# EasyEDA Pro project TF_MUX_v0.8.0-rc.epro, board PCB5_3
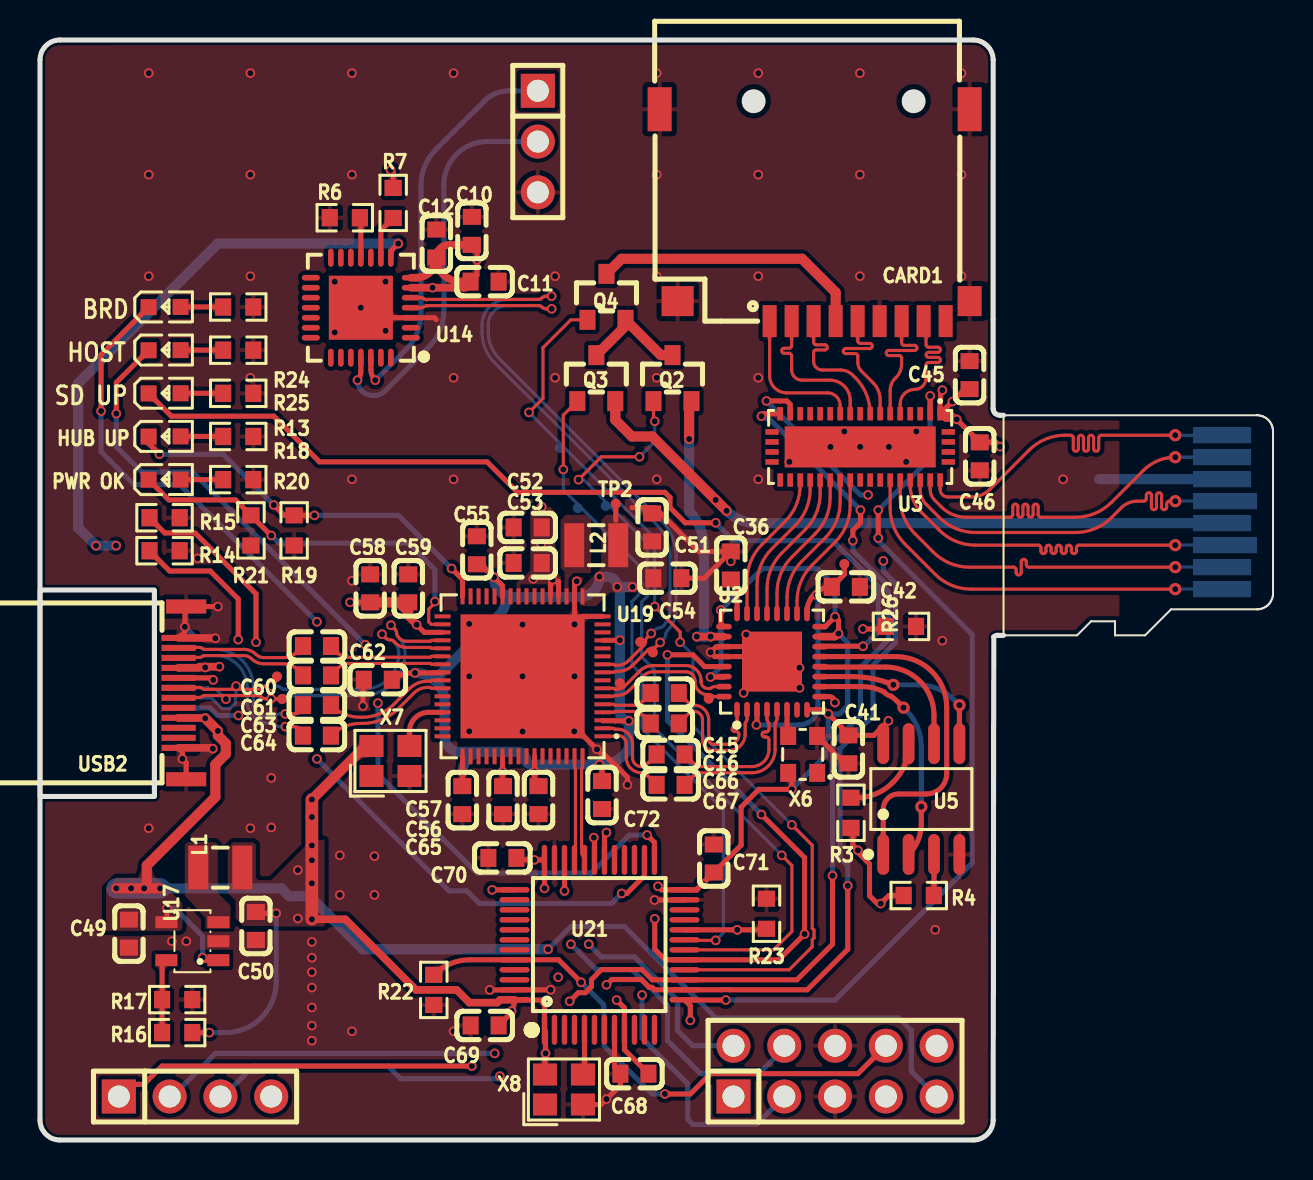
[diagram p1: board, top side]
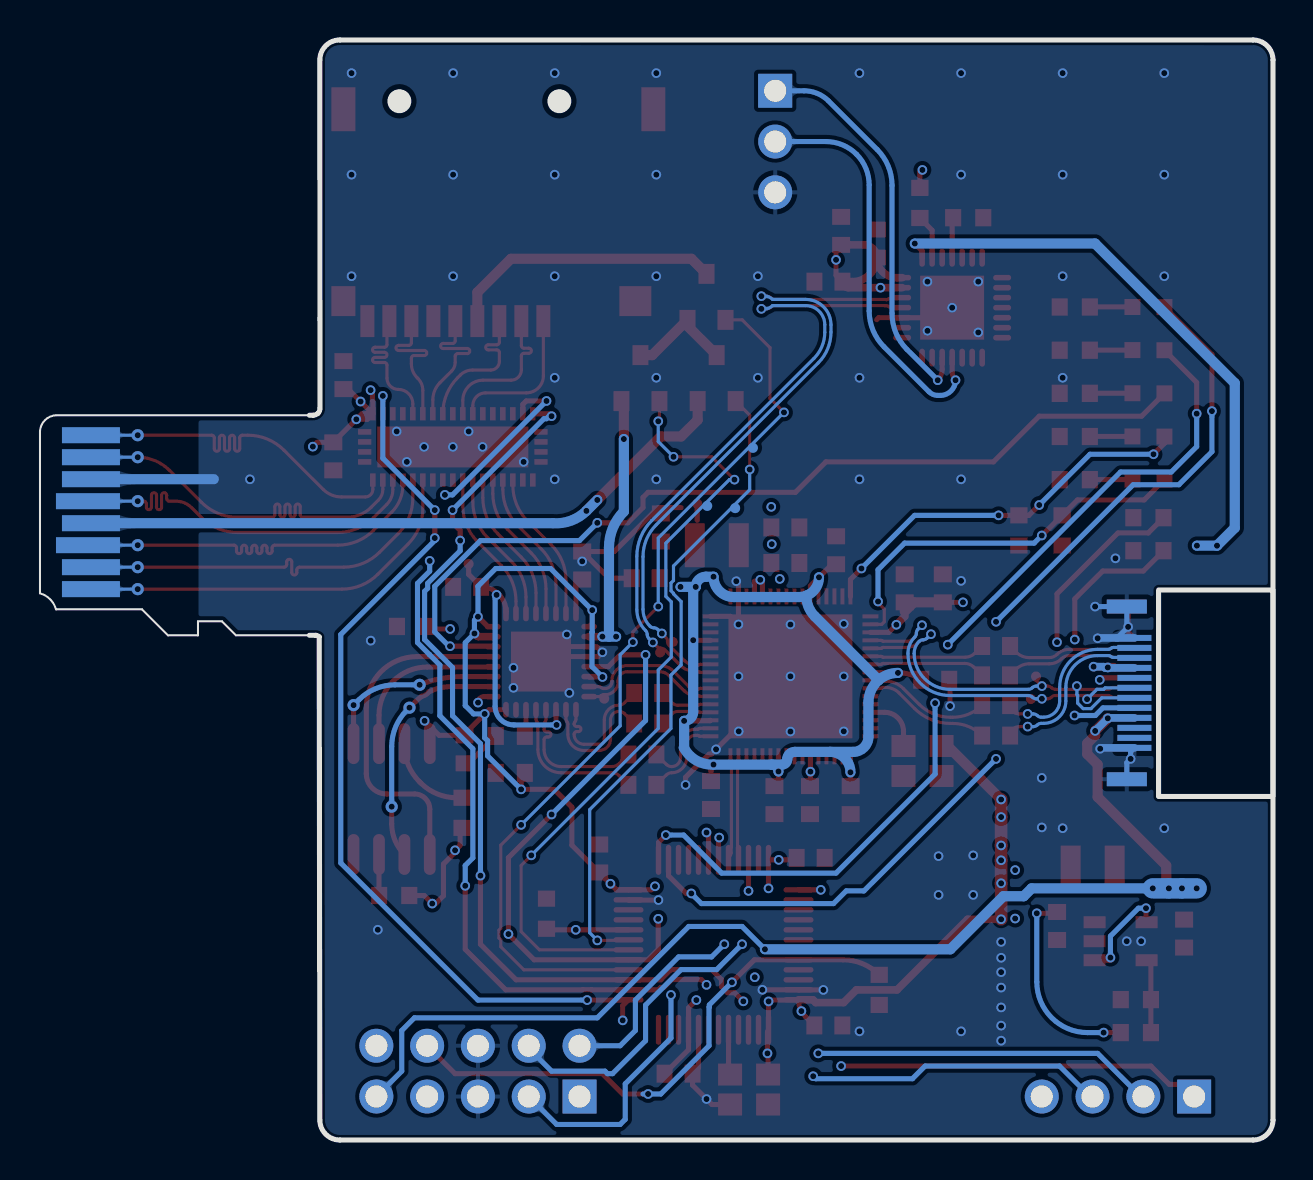
[diagram p2: board, bottom side, seen from below]

Outline 61.66 x 55.03 mm; copper layers: Top Layer, Inner1, Inner2, Bottom Layer. Coordinates in mm from the lower left corner of the outline.
Outline path: rectangle 0,27.52 5.72,17.19 ; 48.18,36.26 48,36.26 arc(47.87,36.29) 47.75,36.36 arc(47.68,36.47) 47.66,36.59 47.66,41.07 47.66,54.03 arc(47.37,54.74) 46.66,55.03 1,55.03 arc(0.29,54.74) 0,54.03 0,1 arc(0.29,0.29) 1,0 46.66,0 arc(47.37,0.29) 47.66,1 47.69,25.17 arc(47.78,25.23) 47.88,25.25 48.18,25.25
Stack: Top Layer 0.035mm 外层铜厚1oz / Dielectric1 0.2104mm 7628 RC49% 8.6mil / Inner1 0.0152mm 内层铜厚 / Dielectric2 1.065mm 1.1mm H/HOZ Copper / Inner2 0.0152mm 内层铜厚 / Dielectric3 0.2104mm 7628 RC49% 8.6mil / Bottom Layer 0.035mm 外层铜厚1oz

## Design rules (mm)
net $1N466: DP1
net RD_TX+: RD_TX
net $1N465: DP1
net RD_TX-: RD_TX
net RD_RX+: RD_RX
net RD_RX-: RD_RX
net RD_D-: RD_D
net RD_D+: RD_D
net HS_D-: HS_D
net HS_D+: HS_D
net SER_D-: SER_D
net SER_D+: SER_D
net UP_D-: UP_D
net UP_D+: UP_D
net UP_RX-: UP_RX
net UP_RX+: UP_RX
net UP_TX+: UP_TX
net UP_TX-: UP_TX
net $1N15963: DP2
net $1N15967: DP2
net $1N16097: DP3
net $1N16103: DP3
net $1N16323: DP4
net $1N16329: DP4
net TS_D-: TS_D
net TS_D+: TS_D
template: 自定义配置
spacing copperThickness1oz (default): track to track 0.102, other pairs 0.152 to 0.3
spacing copperThickness2oz: track to track 0.203, other pairs 0.152 to 0.3
track width copperThickness1oz (default): min 0.127, default 0.254, max 2.54
track width copperThickness2oz: min 0.203, default 0.254, max 2.54
track width TFP: min 0.157, default 0.157, max 0.157
differential pair differentialPair (default): width min 0.127, default 0.157, max 2.54; gap min 0.152, default 0.152
differential pair differentialPair3.0: width min 0.127, default 0.157, max 2.54; gap min 0.152, default 0.152
differential pair differentialPair4: width min 0.127, default 0.157, max 2.54; gap min 0.152, default 0.152
via viaSize (default): diameter min 0.483, default 0.483, max 10; hole min 0.3, default 0.305, max 6.299
net $1N466 uses differentialPair3.0
net RD_TX+ uses differentialPair3.0
net $1N465 uses differentialPair3.0
net RD_TX- uses differentialPair3.0
net TF_DAT1 uses TFP, TF_MUX
net TF_DAT0 uses TFP, TF_MUX
net TF_CLK uses TFP, TF_MUX
net TF_CMD uses TFP, TF_MUX
net TF_DAT3 uses TFP, TF_MUX
net TF_DAT2 uses TFP, TF_MUX
net RD_RX+ uses differentialPair3.0
net RD_RX- uses differentialPair3.0
net UP_DAT1 uses MUX_TS, TFP
net UP_DAT0 uses MUX_TS, TFP
net UP_CLK uses MUX_TS, TFP
net UP_CMD uses MUX_TS, TFP
net UP_DAT3 uses MUX_TS, TFP
net UP_DAT2 uses MUX_TS, TFP
net TS_DAT1 uses MUX_DUT, TFP
net TS_DAT0 uses MUX_DUT, TFP
net TS_CLK uses MUX_DUT, TFP
net TS_CMD uses MUX_DUT, TFP
net TS_DAT3 uses MUX_DUT, TFP
net TS_DAT2 uses MUX_DUT, TFP
net UP_D- uses differentialPair4
net UP_D+ uses differentialPair4
net UP_RX- uses differentialPair3.0
net UP_RX+ uses differentialPair3.0
net UP_TX+ uses differentialPair3.0
net UP_TX- uses differentialPair3.0
net $1N15963 uses differentialPair3.0
net $1N15967 uses differentialPair3.0
net $1N16097 uses differentialPair3.0
net $1N16103 uses differentialPair3.0
net $1N16323 uses differentialPair3.0
net $1N16329 uses differentialPair3.0
diff pair DP1 uses differentialPair3.0
diff pair RD_TX uses differentialPair3.0
diff pair RD_RX uses differentialPair3.0
diff pair UP_D uses differentialPair4
diff pair UP_RX uses differentialPair3.0
diff pair UP_TX uses differentialPair3.0
diff pair DP2 uses differentialPair3.0
diff pair DP3 uses differentialPair3.0
diff pair DP4 uses differentialPair3.0

## Placement (name value [footprint] x y rotation side)
C10  0.1u  [C0603]  21.6 45.48 90 top
C11  0.1u  [C0603]  22.23 42.94 0 top
C12  0.1u  [C0603]  19.82 44.85 270 top
C15  0.1u  [C0603]  31.24 22.36 0 top
C16  0.1u  [C0603]  31.24 20.84 0 top
C36  0.1u  [C0603]  34.54 28.74 90 top
C41  0.1u  [C0603]  40.42 19.54 270 top
C42  0.1u  [C0603]  40.3 27.67 180 top
C45  0.1u  [C0603]  46.48 38.27 270 top
C46  0.1u  [C0603]  46.99 34.2 90 top
C49  10uF  [C0603]  4.45 10.33 90 top
C50  10uF  [C0603]  10.8 10.71 270 top
C51  10uF  [C0603]  30.61 30.65 90 top
C52  10uF  [C0603]  24.38 30.65 0 top
C53  0.1u  [C0603]  24.38 28.87 180 top
C54  0.1u  [C0603]  31.37 28.11 180 top
C55  0.1u  [C0603]  21.84 29.5 90 top
C56  0.1u  [C0603]  23.15 17 270 top
C57  0.1u  [C0603]  21.12 17 270 top
C58  10uF  [C0603]  16.51 27.6 90 top
C59  0.1u  [C0603]  18.42 27.6 270 top
C60  0.1u  [C0603]  13.85 24.71 0 top
C61  0.1u  [C0603]  13.85 23.25 0 top
C62  0.1u  [C0603]  16.89 23.03 0 top
C63  330n  [C0603]  13.84 21.76 0 top
C64  330n  [C0603]  13.84 20.23 0 top
C65  0.1u  [C0603]  24.93 17 90 top
C66  0.1u  [C0603]  31.53 19.29 0 top
C67  0.1u  [C0603]  31.53 17.77 0 top
C68  0.1u  [C0603]  29.72 3.32 0 top
C69  0.1u  [C0603]  22.23 5.73 180 top
C70  0.1u  [C0603]  23.12 14.11 0 top
C71  0.1u  [C0603]  33.69 14.08 270 top
C72  0.1u  [C0603]  28.1 17.26 270 top
CARD1  TF PUSH  [TF-SMD_TF-PUSH]  38.74 46.27 180 top
H2  -  [HDR-TH_3P-P2.54-V-M]  24.89 49.95 270 top
H3  -  [HDR-TH_10P-P2.54-V-M-R2-C5-S2.54]  39.76 3.45 0 top
H4  -  [HDR-TH_4P-P2.54-V-M]  7.75 2.18 0 top
L1  2.2uH  [IND-SMD_L2.5-W2.0_MHCHL2520]  9.02 13.63 180 top
L2  2.2uH  [IND-SMD_L2.5-W2.0_MHCHL2520]  27.81 29.76 0 top
LED5  LTST-C191KSKT  [LED0603-RD-YELLOW]  6.23 37.36 0 top
LED6  LTST-C191KSKT  [LED0603-RD-YELLOW]  6.23 35.2 0 top
LED7  LTST-C191KSKT  [LED0603-RD-YELLOW]  6.23 33.04 0 top
LED8  LTST-C191KSKT  [LED0603-RD-YELLOW]  6.23 41.67 0 top
LED9  LTST-C191KSKT  [LED0603-RD-YELLOW]  6.23 39.51 0 top
Q2  AO3401A  [SOT-23_L2.9-W1.3-P1.90-LS2.4-BR]  31.63 38.12 270 top
Q3  AO3401A  [SOT-23_L2.9-W1.3-P1.90-LS2.4-BR]  27.82 38.12 270 top
Q4  AO3401A  [SOT-23_L2.9-W1.3-P1.90-LS2.4-BR]  28.33 42.18 270 top
R3  1k  [R0603]  40.55 16.37 270 top
R4  1k  [R0603]  43.94 12.23 0 top
R6  10k  [R0603]  15.24 46.14 0 top
R7  4.7k  [R0603]  17.66 46.88 90 top
R13  1k  [R0603]  9.91 37.36 0 top
R14  5.1K  [R0603]  6.23 29.48 0 top
R15  5.1K  [R0603]  6.23 31.13 0 top
R16  68K  [R0603]  6.86 5.37 180 top
R17  15K  [R0603]  6.86 7.03 0 top
R18  1k  [R0603]  9.91 35.2 0 top
R19  10k  [R0603]  12.71 30.5 270 top
R20  1k  [R0603]  9.91 33.04 0 top
R21  10k  [R0603]  10.55 30.5 270 top
R22  10k  [R0603]  19.69 7.51 90 top
R23  10k  [R0603]  36.33 11.32 90 top
R24  1k  [R0603]  9.91 41.67 0 top
R25  1k  [R0603]  9.91 39.51 0 top
R26  680  [R0603]  43.05 25.69 180 top
TP1  -  [Test-Point-0.5mm]  40.22 28.82 0 top
TP2  -  [Test-Point-0.5mm]  28.79 31.83 0 top
TP3  -  [Test-Point-0.5mm]  30.01 24.92 0 top
TP4  -  [Test-Point-0.5mm]  30.65 24.39 0 top
TP5  -  [Test-Point-0.5mm]  29 22.86 0 top
TP6  -  [Test-Point-0.5mm]  33.44 22.08 0 top
TP7  -  [Test-Point-0.5mm]  12.11 22.06 0 top
TP8  -  [Test-Point-0.5mm]  11.85 23.19 0 top
TP9  -  [Test-Point-0.5mm#2]  26.01 34.63 0 top
TP10  -  [Test-Point-0.5mm#2]  28.29 31.72 0 top
TP11  -  [Test-Point-0.5mm]  26.89 31.61 180 bottom
U2  GL3224-OIY04  [HQFN-32_L5.0-W5.0-P0.50-BL-EP3.0]  36.6 23.93 0 top
U3  TS3DV642A0RUAR  [WFQFN-42_L9.0-W3.5-P0.50-BL-EP]  41.01 34.68 180 top
U5  W25X05CLSNIG  [SOIC-8_L4.9-W3.9-P1.27-LS6.0-BL]  44.07 17.06 0 top
U9  TF卡插头  [TF卡封装]  59.18 31.41 180 top
U14  CP2102-GMR  [WQFN-28_L5.0-W5.0-P0.50-BL-EP3.2]  16.04 41.64 90 top
U17  TLV62568DBVR  [SOT-23-5_L3.0-W1.7-P0.95-LS2.8-BR]  7.62 9.95 0 top
U19  CH634W6G  [QFN-64_L8.0-W8.0-P0.40-TL-EP6.2]  24.13 23.2 180 top
U21  CH32V203C8T6  [LQFP-48_L7.0-W7.0-P0.50-LS9.0-BL]  27.98 9.77 0 top
USB2  MC-233J08H93  [USB-C-SMD_TYPE-C-31-M-20]  7.12 22.37 270 top
X6  25MHz  [OSC-SMD_4P-L2.5-W2.0-BL-1]  38.14 19.29 90 top
X7  24MHz  [OSC-SMD_4P-L2.5-W2.0-BL]  17.53 18.96 0 top
X8  24MHz  [OSC-SMD_4P-L2.5-W2.0-BL]  26.2 2.53 0 top

## Footprints (pads in the part's own frame, mm; a bottom-side part is the same pattern mirrored in y, then rotated)
C0603
  rect 0.8x0.9 smd: 1(-0.7,0) 2(0.7,0)
HDR-TH_3P-P2.54-V-M
  rect 1.7x1.7 hole 1.1: 1(-2.54,0)
  round 1.7 hole 1.1: 2(0,0) 3(2.54,0)
HDR-TH_4P-P2.54-V-M
  rect 1.7x1.7 hole 1.1: 1(-3.81,0)
  round 1.7 hole 1.1: 2(-1.27,0) 3(1.27,0) 4(3.81,0)
HDR-TH_10P-P2.54-V-M-R2-C5-S2.54
  rect 1.7x1.7 hole 1.1: 1(-5.08,-1.27)
  round 1.7 hole 1.1: 2(-5.08,1.27) 3(-2.54,-1.27) 4(-2.54,1.27) 5(0,-1.27) 6(0,1.27) 7(2.54,-1.27) 8(2.54,1.27) 9(5.08,-1.27) 10(5.08,1.27)
HQFN-32_L5.0-W5.0-P0.50-BL-EP3.0
  oval 0.28x0.785 smd: 1(-1.75,-2.408) 2(-1.25,-2.408) 3(-0.75,-2.408) 4(-0.25,-2.408) 5(0.25,-2.408) 6(0.75,-2.408) 7(1.25,-2.408) 8(1.75,-2.408) 17(1.75,2.408) 18(1.25,2.408) 19(0.75,2.408) 20(0.25,2.408) 21(-0.25,2.408) 22(-0.75,2.408) 23(-1.25,2.408) 24(-1.75,2.408)
  oval 0.785x0.28 smd: 9(2.408,-1.75) 10(2.408,-1.25) 11(2.408,-0.75) 12(2.408,-0.25) 13(2.408,0.25) 14(2.408,0.75) 15(2.408,1.25) 16(2.408,1.75) 25(-2.408,1.75) 26(-2.408,1.25) 27(-2.408,0.75) 28(-2.408,0.25) 29(-2.408,-0.25) 30(-2.408,-0.75) 31(-2.408,-1.25) 32(-2.408,-1.75)
  rect 3x3 smd: 33(0,0)
IND-SMD_L2.5-W2.0_MHCHL2520
  rect 1x2.2 smd: 1(-1.1,0) 2(1.1,0)
LED0603-RD-YELLOW
  rect 0.8x0.8 smd: 1(-0.799,-0.004) 2(0.799,0.004)
LQFP-48_L7.0-W7.0-P0.50-LS9.0-BL
  oval 0.27x1.5 smd: 1(-2.75,-4.25) 2(-2.25,-4.25) 3(-1.75,-4.25) 4(-1.25,-4.25) 5(-0.75,-4.25) 6(-0.25,-4.25) 7(0.25,-4.25) 8(0.75,-4.25) 9(1.25,-4.25) 10(1.75,-4.25) 11(2.25,-4.25) 12(2.75,-4.25) 25(2.75,4.25) 26(2.25,4.25) 27(1.75,4.25) 28(1.25,4.25) 29(0.75,4.25) 30(0.25,4.25) 31(-0.25,4.25) 32(-0.75,4.25) 33(-1.25,4.25) 34(-1.75,4.25) 35(-2.25,4.25) 36(-2.75,4.25)
  oval 1.5x0.27 smd: 13(4.25,-2.75) 14(4.25,-2.25) 15(4.25,-1.75) 16(4.25,-1.25) 17(4.25,-0.75) 18(4.25,-0.25) 19(4.25,0.25) 20(4.25,0.75) 21(4.25,1.25) 22(4.25,1.75) 23(4.25,2.25) 24(4.25,2.75) 37(-4.25,2.75) 38(-4.25,2.25) 39(-4.25,1.75) 40(-4.25,1.25) 41(-4.25,0.75) 42(-4.25,0.25) 43(-4.25,-0.25) 44(-4.25,-0.75) 45(-4.25,-1.25) 46(-4.25,-1.75) 47(-4.25,-2.25) 48(-4.25,-2.75)
OSC-SMD_4P-L2.5-W2.0-BL
  rect 1.2x1.1 smd: 1(-0.95,-0.75) 2(0.95,-0.75) 3(0.95,0.75) 4(-0.95,0.75)
OSC-SMD_4P-L2.5-W2.0-BL-1
  rect 0.9x0.8 smd: 1(-0.925,-0.725) 2(0.925,-0.725) 3(0.925,0.725) 4(-0.925,0.725)
QFN-64_L8.0-W8.0-P0.40-TL-EP6.2
  rect 0.8x0.2 smd: 1(-4,3) 2(-4,2.6) 3(-4,2.2) 4(-4,1.8) 5(-4,1.4) 6(-4,1) 7(-4,0.6) 8(-4,0.2) 9(-4,-0.2) 10(-4,-0.6) 11(-4,-1) 12(-4,-1.4) 13(-4,-1.8) 14(-4,-2.2) 15(-4,-2.6) 16(-4,-3) 33(4,-3) 34(4,-2.6) 35(4,-2.2) 36(4,-1.8) 37(4,-1.4) 38(4,-1) 39(4,-0.6) 40(4,-0.2) 41(4,0.2) 42(4,0.6) 43(4,1) 44(4,1.4) 45(4,1.8) 46(4,2.2) 47(4,2.6) 48(4,3)
  rect 0.2x0.8 smd: 17(-3,-4) 18(-2.6,-4) 19(-2.2,-4) 20(-1.8,-4) 21(-1.4,-4) 22(-1,-4) 23(-0.6,-4) 24(-0.2,-4) 25(0.2,-4) 26(0.6,-4) 27(1,-4) 28(1.4,-4) 29(1.8,-4) 30(2.2,-4) 31(2.6,-4) 32(3,-4) 49(3,4) 50(2.6,4) 51(2.2,4) 52(1.8,4) 53(1.4,4) 54(1,4) 55(0.6,4) 56(0.2,4) 57(-0.2,4) 58(-0.6,4) 59(-1,4) 60(-1.4,4) 61(-1.8,4) 62(-2.2,4) 63(-2.6,4) 64(-3,4)
  rect 6.2x6.2 smd: 65(0,0)
R0603
  rect 0.806x0.864 smd: 1(-0.753,0) 2(0.753,0)
SOIC-8_L4.9-W3.9-P1.27-LS6.0-BL
  oval 0.588x2.045 smd: 1(-1.905,-2.772) 2(-0.635,-2.772) 3(0.635,-2.772) 4(1.905,-2.772) 5(1.905,2.772) 6(0.635,2.772) 7(-0.635,2.772) 8(-1.905,2.772)
SOT-23-5_L3.0-W1.7-P0.95-LS2.8-BR
  rect 1.1x0.6 smd: 1(1.3,-0.95) 2(1.3,0) 3(1.3,0.95) 4(-1.3,0.95) 5(-1.3,-0.95)
SOT-23_L2.9-W1.3-P1.90-LS2.4-BR
  rect 1x0.8 smd: 1(1.15,-0.95) 2(1.15,0.95) 3(-1.15,0)
Test-Point-0.5mm
  round 0.5 smd: 1(0,0)
Test-Point-0.5mm#2
  round 0.5 smd far side: 1(0,0)
TF-SMD_TF-PUSH
  rect 0.7x1.6 smd: 1(2.25,5.3) 2(1.15,5.3) 3(0.05,5.3) 4(-1.05,5.3) 5(-2.15,5.3) 6(-3.25,5.3) 7(-4.35,5.3) 8(-5.45,5.3) CD(-6.55,5.3)
  rect 1.2x1.5 smd: 10(-7.75,4.3)
  rect 1.2x2.2 smd: 11(-7.75,-5.3) 12(7.75,-5.3)
  rect 1.6x1.5 smd: 13(6.85,4.3)
TF卡封装
  rect 2.9x0.8 smd far side: 1(0.075,3.85) 2(0.074,2.751) 4(0.075,0.551) 6(0.074,-1.651) 7(0.074,-2.751) 8(0.074,-3.85)
  rect 3.2x0.8 smd far side: 3(-0.074,1.65) 5(-0.075,-0.551)
USB-C-SMD_TYPE-C-31-M-20
  rect 0.7x2 smd: 25(-4.32,0.192) 25(4.32,0.192)
  rect 0.7x2 smd far side: 25(-4.32,0.192) 25(4.32,0.192)
  rect 0.3x1.7 smd: A1(-2.75,-0.188) A2(-2.25,-0.188) A3(-1.75,-0.188) A4(-1.25,-0.188) A5(-0.75,-0.188) A6(-0.25,-0.188) A7(0.25,-0.188) A8(0.75,-0.188) A9(1.25,-0.188) A10(1.75,-0.188) A11(2.25,-0.188) A12(2.75,-0.188)
  rect 0.3x1.7 smd far side: B1(2.75,-0.188) B2(2.25,-0.188) B3(1.75,-0.188) B4(1.25,-0.188) B5(0.75,-0.188) B6(0.25,-0.188) B7(-0.254,-0.192) B8(-0.75,-0.188) B9(-1.25,-0.188) B10(-1.75,-0.188) B11(-2.25,-0.188) B12(-2.75,-0.188)
WFQFN-42_L9.0-W3.5-P0.50-BL-EP
  rect 0.28x0.665 smd: 1(-3.998,-1.657) 2(-3.498,-1.657) 3(-2.998,-1.657) 4(-2.498,-1.657) 5(-1.998,-1.657) 6(-1.498,-1.657) 7(-0.998,-1.657) 8(-0.497,-1.657) 9(0.003,-1.657) 10(0.502,-1.657) 11(1.002,-1.657) 12(1.502,-1.657) 13(2.002,-1.657) 14(2.502,-1.657) 15(3.002,-1.657) 16(3.502,-1.657) 17(4.003,-1.657) 22(4.003,1.657) 23(3.502,1.657) 24(3.002,1.657) 25(2.502,1.657) 26(2.002,1.657) 27(1.502,1.657) 28(1.002,1.657) 29(0.502,1.657) 30(0.003,1.657) 31(-0.497,1.657) 32(-0.998,1.657) 33(-1.498,1.657) 34(-1.998,1.657) 35(-2.498,1.657) 36(-2.998,1.657) 37(-3.498,1.657) 38(-3.998,1.657)
  rect 0.665x0.28 smd: 18(4.41,-0.75) 19(4.41,-0.25) 20(4.41,0.25) 21(4.41,0.75) 39(-4.405,0.75) 40(-4.405,0.25) 41(-4.405,-0.25) 42(-4.405,-0.75)
  rect 7.55x2.05 smd: 43(0.003,0)
WQFN-28_L5.0-W5.0-P0.50-BL-EP3.2
  oval 0.28x0.9 smd: 1(-1.501,-2.5) 2(-1.001,-2.5) 3(-0.5,-2.5) 4(0,-2.5) 5(0.5,-2.5) 6(1,-2.5) 7(1.501,-2.5) 15(1.501,2.5) 16(1,2.5) 17(0.5,2.5) 18(0,2.5) 19(-0.5,2.5) 20(-1.001,2.5) 21(-1.501,2.5)
  oval 0.9x0.28 smd: 8(2.5,-1.502) 9(2.5,-1.001) 10(2.5,-0.5) 11(2.5,-0.001) 12(2.5,0.5) 13(2.5,1) 14(2.5,1.501) 22(-2.5,1.501) 23(-2.5,1) 24(-2.5,0.5) 25(-2.5,-0.001) 26(-2.5,-0.5) 27(-2.5,-1.001) 28(-2.5,-1.502)
  rect 3.2x3.2 smd: 29(0,-0.001)

## Nets
As in the schematic.

Pads without a net: CARD1 CD; U2 7; U3 3 4 9 12 13 14 15 18 19 20 21 22 23 30 31 32 39 40 41 42; U14 1 2 10 12 13 14 15 16 17 18 19 20 21 22 23 24 27 28; U19 8 11 12 14 15 22 23 24 26 28 29 30 31 33 43 44 46 47 48 50 51 52 53 55 56 57 59 60 61 62; U21 2 3 4 6 7 10 11 12 21 22 27 28 29 38 39 40 41 45 46; USB2 A8 B8; X6 1; X7 1; X8 1

## Via types
v1: diameter 0.482, hole 0.305, Top Layer to Bottom Layer, 246 vias
v2: diameter 0.61, hole 0.305, Top Layer to Bottom Layer, 10 vias

## Routing (per net, layer and track width the routed paths; a pad name or vN(x,y) marks a point on that pad's centre or on a via; arc(x,y) is an arc through that point)
+5V: length 134.1
  Top Layer w0.254: U17.1 8.19,9 arc(8.08,9.02) v1(8.13,9.13) ; v1(6.35,11.6) 6.35,10.93 arc(6.34,10.9) 6.32,10.9 ; v1(17.91,44.85) 17.55,44.48 U14.8
  Top Layer w0.381: USB2.A9 6.94,21.11 8.25,21.11 ; USB2.A4 6.94,23.63 7.92,23.63 7.98,23.68 v1(8.97,23.68)
  Top Layer w0.508: 5.34,12.59 v1(5.21,12.59) v1(4.55,12.59) v1(3.82,12.59) ; 5.34,12.59 v1(6.01,12.59) ; 5.34,12.59 5.34,13.73 8.77,17.16 8.77,18.79 9.29,19.31 9.29,19.84 8.89,20.24 v1(8.89,20.47) v1(8.26,21.1)
  Inner2 w0.508: 7.25,23.64 7.25,24.76 7.89,25.4 7.89,26.57 8.01,26.69 8.01,27.2 5.47,29.73 v1(3.81,29.73) v1(2.8,29.73) ; 7.25,23.64 6.89,23.28 6.89,22.77 8.26,21.4 v1(8.26,21.1) ; 7.25,23.64 v1(8.26,23.64) arc(8.52,23.67) 8.77,23.66 8.96,23.66 8.97,23.67 8.97,23.67 v1(8.97,23.68)
  Inner2 w1.016: v1(3.82,12.59) v1(4.55,12.59) ; v1(4.55,12.59) 5.09,13.12 5.09,13.52 5.8,12.8 v1(6.01,12.59) v1(5.21,12.59) v1(4.55,12.59)
  Inner2 w1.143: v1(8.26,21.1) 8.7,21.1 8.7,21.09 9.26,20.52 9.28,20.52 9.91,19.89 9.91,16.91 5.09,12.08
  Bottom Layer w0.254: v1(25.41,9.54) 26.55,10.69 29.22,10.69 33.79,6.11 42.93,6.11 43.57,5.48 43.57,3.45 H3.9 ; v1(6.35,11.6) 6.73,11.6 8.13,10.2 v1(8.13,9.13)
  Bottom Layer w0.381: 8.28,23.62 v1(8.26,23.64) ; 8.28,23.62 USB2.A4 ; 8.28,23.62 8.41,23.62 8.47,23.68 v1(8.97,23.68) ; USB2.A9 8.24,21.12 v1(8.89,20.47)
  Bottom Layer w0.508: v1(3.81,29.73) v1(2.8,29.73) 1.91,30.62 1.91,37.86 8.9,44.85 v1(17.91,44.85) ; v1(6.01,12.59) 12.07,12.59 12.46,12.2 13.48,12.2 16.14,9.54 v1(25.41,9.54)
  Bottom Layer w1.016: v1(6.01,12.59) v1(5.21,12.59) v1(4.55,12.59) v1(3.82,12.59)
GND: length 71.1
  Top Layer w0.254: 36.35,24.18 U2.33 ; 36.35,24.18 U2.28 33.75,24.18 v1(33.53,24.4) 33.8,24.66 33.89,24.66 33.91,24.68 U2.27 35.85,24.68 36.35,24.18 ; 24.13,23.2 v1(26.73,25.8) ; v1(26.73,25.8) 27.13,26.2 U19.16 ; v1(26.73,25.8) 26.73,27.84 v1(26.84,27.96) ; v1(26.73,25.8) v1(24.13,23.2) ; USB2.A12 7.12,19.43 v1(7.12,19.07) 7.31,18.88 7.31,18.05 ; v1(30.73,12) 32.22,12 U21.23 ; C54.1 33.21,28.11 C36.2 32.94,29.44 30.74,31.64 29.6,31.64 ; v1(25.53,7.52) U21.47 arc(23.72,7.51) 23.71,7.51 v1(22.48,7.51) ; X6.2 40.23,18.84 C41.2 ; C62.1 16.15,22.98 v1(16.15,21.71) ; USB2.A1 7.25,25.43 v1(7.25,25.67) 7.25,26.62 7.31,26.69 8.89,26.69 v1(8.9,26.69) ; v1(16.04,41.64) 16.54,41.14 U14.3 19.72,41.14 19.82,41.04 ; U21.8 28.73,3.62 C68.1 29.02,2.75 v1(28.33,2.05) 28.05,1.78 X8.2 ; v1(29.37,17.77) 29.37,18.15 28.48,19.04 28.46,19.04 28.19,19.3 28.09,19.3 v1(27.85,19.54) 27.11,20.28 arc(26.93,20.4) v1(26.72,20.45)
  Top Layer w0.381: v1(8.64,19.58) 8.6,19.62 USB2.A12 ; USB2.A1 8.75,25.12 v1(8.77,25.1)
  Bottom Layer w0.254: 7.31,18.05 7.31,18.88 v1(7.12,19.07) 7.12,19.43 USB2.A12 ; v1(8.9,26.69) 7.31,26.69 7.31,26.69 7.31,25.74 v1(7.25,25.67) 7.81,25.1
  Bottom Layer w0.381: USB2.A12 8.6,19.62 v1(8.64,19.58) ; USB2.A1 8.75,25.12 v1(8.77,25.1)
  Bottom Layer w0.508: U9.6 52.96,33.06
  vias: v1(5.44,53.37) v1(5.44,48.29) v1(5.44,43.21) v1(5.44,15.6) v1(6.59,9.95) v1(7.31,9.95) v1(7.88,29.1) v1(10.52,53.37) v1(10.52,48.29) v1(10.52,43.21) v1(10.52,38.13) v1(10.52,15.6) v1(11.56,18.12) v1(11.56,15.64) v1(13.6,9.91) v1(13.6,9.12) v1(13.6,8.4) v1(13.6,7.63) v1(13.6,6.63) v1(13.6,5.72) v1(13.6,4.97) v1(14.74,42.94) v1(14.74,40.4) v1(14.99,14.24) v1(14.99,12.26) v1(15.6,53.37) v1(15.6,48.29) v1(15.6,33.05) v1(15.6,27.97) v1(15.6,5.44) v1(16.72,14.2) v1(16.72,12.26) v1(17.28,42.94) v1(17.28,40.48) v1(20.68,53.37) v1(20.68,38.13) v1(20.68,33.05) v1(20.68,5.44) v1(21.46,25.82) v1(21.46,23.2) v1(21.46,20.45) v1(24.13,25.79) v1(24.13,20.44) v1(25.76,43.21) v1(25.76,38.13) v1(26.73,23.2) v1(30.84,53.37) v1(30.84,48.29) v1(30.84,43.21) v1(30.84,38.13) v1(30.84,33.05) v1(34.54,28.95) v1(35.19,22.37) v1(35.31,25.29) v1(35.92,53.37) v1(35.92,48.29) v1(35.92,43.21) v1(35.92,38.13) v1(35.92,33.05) v1(37.47,33.93) v1(37.98,23.63) v1(37.98,22.62) v1(39.53,34.68) v1(40.22,35.45) v1(41,53.37) v1(41,48.29) v1(41,43.21) v1(41.01,34.68) v1(42.45,34.68) v1(43.31,33.93) v1(43.82,35.45) v1(44.76,10.52) v1(45.12,24.98) v1(46.08,53.37) v1(46.08,48.29) v1(46.08,43.21) v1(51.16,33.05)
VCC: length 338.8
  Top Layer w0.254: 18.42,26.45 C59.2 ; C10.1 21.85,44.53 v1(21.85,44.03) 21.85,43.26 C11.1 ; U3.1 v1(45.62,36.95) 46.25,37.57 C45.2 ; U3.1 45.29,36.05 v1(45.84,36.05) ; U3.1 45.01,36.99 45.03,37.01 45.03,37.42 v1(45.12,37.51) ; U3.1 45.35,36.33 ; U19.21 25.53,27.92 v1(25.64,28.03) ; v1(30.9,12.69) 31.08,12.52 U21.24 32.82,12.52 v1(33.13,12.82) C71.2 35.06,14.75 35.06,16.65 35.95,17.54 v1(37.6,17.54) 37.6,18.18 X6.4 ; R7.2 17.66,48.4 v1(17.53,48.53) ; U2.25 34.04,25.84 34.04,26.56 ; 40.65,15.58 40.65,14.74 40.82,14.56 ; C69.1 23.38,6.18 arc(23.49,6.31) v1(23.58,6.45) arc(23.69,6.72) U21.48 arc(23.74,7.01) 23.76,7 25.28,7 arc(25.24,6.94) 25.23,6.88 U21.1 arc(25.27,5.46) 25.28,5.39 v1(25.28,4.34) arc(25.26,4.3) 25.25,4.26 X8.4 ; v1(45.84,36.05) C46.2 47.8,34.9 v1(48.01,34.69) ; v1(45.84,36.05) 45.56,36.33 45.35,36.33 ; v1(42.42,20.97) 42.16,20.71 ; 42.16,20.71 41.7,20.24 C41.1 40.42,20.31 v1(39.42,21.32) 39.21,21.53 U2.8 ; 42.16,20.71 U5.8 ; v1(18.83,25.78) 19.21,25.4 U19.35 ; C68.2 29.23,4.52 U21.9 29.23,6.61 v1(28.83,7) ; R16.1 v1(8.47,5.37) ; U2.30 34.18,23.16 v1(33.53,23.16) ; C56.1 23.13,17.73 v1(23.13,18.43) U19.54 ; v1(42.04,11.83) 42.45,12.23 43.19,12.23 ; 45.35,36.33 45.47,36.21 ; 42.07,11.83 41.87,11.83 41.48,12.22 41.48,13.81 40.88,14.41 ; v1(25.23,12.59) U21.36 v1(24.72,14.02) 23.92,14.02 C70.2 ; v1(15.5,26.9) C58.1 ; U19.20 25.93,27.96 ; v1(39.93,25.34) 39.93,26 v1(39.76,26.18) 39.26,25.68 U2.16 ; v1(11.81,11.34) 10.86,11.34 arc(10.81,11.36) 10.8,11.41
  Top Layer w0.381: C10.1 20.45,44.78 arc(20,44.6) C12.2 ; v1(39.93,25.34) 39.82,25.23 39.77,25.23 39.73,25.18 U2.15 ; U14.6 v1(19.63,42.64) 21.23,42.64 arc(21.44,42.73) C11.1 21.02,42.94 arc(20.17,43.3) C12.2 ; 18.54,43.14 18.81,43.14 arc(19.52,43.44) C12.2 ; v1(13.6,11.04) 15.27,11.04 18.8,7.51 20.83,7.51 21.47,6.88 22.87,6.88 23.01,7.02 U21.48 ; 18.42,26.45 18.42,26.2 v1(18.83,25.78)
  Top Layer w0.508: C58.1 17.97,26.9 18.42,26.45 ; v1(13.6,17.04) 16.27,19.71 X7.4
  Top Layer w0.635: v1(13.6,17.04) v1(13.6,16.16) v1(13.6,14.74) v1(13.6,14) v1(13.6,12.84) v1(13.6,11.04)
  Inner2 w0.254: v1(30.9,12.69) 33,12.69 v1(33.13,12.82) ; v1(45.12,37.51) 45.62,37.01 ; 21.85,43.01 21.48,42.64 v1(19.63,42.64)
  Inner2 w0.508: 38.23,19.52 38.23,18.18 v1(37.6,17.54)
  Inner2 w0.762: v1(42.04,11.83) 42.04,11.67 39.96,9.59 ; 41.28,14.5 v1(40.9,14.5) 39.63,14.5 37.47,12.34 ; v1(33.53,23.16) 34.84,23.16 34.86,23.14 35.37,23.14 36.58,24.36 ; 39.96,9.59 39.01,10.55 39.01,10.62 38.55,11.08 38.47,11.08 37.6,11.96 37.6,12.08 37.06,12.62 33.33,12.62 v1(33.13,12.82) ; 39.96,9.59 H3.10 ; v1(23.58,6.45) 23.87,6.74 25.42,6.74 26.17,5.99 27.82,5.99 28.71,6.88
  Inner2 w1.016: 28.92,16.57 28.75,16.74 26.55,16.74 24.52,14.7 24.52,14.22 ; 28.92,16.57 29.21,16.87 29.75,16.87 32.42,19.53 38.21,19.53 ; 28.92,16.57 29.47,16.02 29.47,15.64 29.46,15.63 29.46,14.63 30.49,13.61 32.35,13.61 v1(33.13,12.82) ; v1(13.6,12.84) 12.94,13.5 v1(12.89,13.5) 13.6,14.2 ; v1(13.6,12.84) v1(13.6,11.04) ; v1(13.6,12.84) v1(13.6,14) 13.6,14.2 ; 41.39,28.07 42.54,28.07 43.17,28.7 43.17,29.85 47.76,34.44 47.76,34.82 45.63,36.95 ; 13.6,14.2 v1(13.6,14.74) 14.24,15.38 20.08,15.38 ; 22.57,24.8 22.57,18.99 v1(23.13,18.43) 22.36,17.66 ; 22.57,24.8 22.44,24.92 21.09,24.92 20.23,25.78 v1(18.83,25.78) 17.71,26.9 v1(15.5,26.9) ; 22.57,24.8 22.57,27.07 ; 22.36,18.81 22.36,17.66 ; 22.36,17.66 20.08,15.38 ; 38.21,19.53 41.11,19.53 42.42,20.84 v1(42.42,20.97) ; 38.21,19.53 38.23,19.52 ; 21.85,44.59 v1(21.85,44.03) 21.85,35.96 21.72,35.83 21.72,34.86 ; 20.08,15.38 20.08,11.11 20.01,11.04 ; 20.08,15.38 23.35,15.38 24.52,14.22 ; v1(13.6,11.04) 13.3,11.34 v1(11.81,11.34) ; v1(13.6,11.04) 20.01,11.04 ; 45.62,36.95 45.41,37.16 45.41,36.48 v1(45.84,36.05) ; 45.62,36.95 v1(45.62,36.95) ; 45.62,36.95 45.62,37.84 43.82,39.64 28.08,39.64 27.19,38.75 27.19,37.71 27.3,37.61 26.82,37.13 26.82,37.08 24.6,34.86 21.72,34.86 ; 24.08,6.74 24.08,7.82 20.86,11.04 20.01,11.04 ; 24.52,14.22 v1(24.72,14.02) 25.23,13.5 v1(25.23,12.59) ; v1(24.66,28.07) 25.06,28.47 v1(25.06,29.81) ; v1(24.66,28.07) 24.71,28.03 v1(25.64,28.03) ; v1(24.66,28.07) 23.66,27.07 22.57,27.07 ; 36.58,25.59 37.17,26.18 39.5,26.18 ; 36.58,25.59 36.58,22.24 37.63,21.19 39.17,21.19 ; 36.58,25.59 36.58,26.18 36.25,26.51 v1(34.04,26.51) ; 21.98,44.85 18.29,48.53 v1(17.53,48.53) ; 21.72,34.86 21.72,27.32 ; 22.57,27.07 21.85,27.07
  Bottom Layer w0.254: v1(8.47,5.37) 9.27,5.37 arc(11.07,6.12) 11.81,7.91 v1(11.81,11.34) ; v1(33.53,23.16) 34.05,23.69 34.05,25.4 34.04,25.41 v1(34.04,26.51) 36.12,28.59 38.87,28.59 39.76,27.7 v1(39.76,26.18) 39.93,26 v1(39.93,25.34) 40.39,24.88 40.39,21.73 39.97,21.32 v1(39.42,21.32) 39.42,20.12 39.27,19.98 39.27,19.22 v1(37.6,17.54)
  vias: v1(12.89,11.08) v1(25.09,31.68) v1(25.22,6.94)
25CLKIN: length 1.3
  Top Layer w0.254: U2.6 37.35,20.36 arc(37.37,20.28) X6.3
BOOT0: length 28
  Top Layer w0.254: v1(31.25,2.3) 32.52,2.3 33.53,3.32 40.9,3.32 H3.8 ; R22.2 19.7,8.27 arc(20.52,8.82) 21.5,9.02 U21.44 25.93,9.02 v1(27.06,7.89)
  Bottom Layer w0.254: 31.5,2.3 v1(31.25,2.3) 30.61,2.3 28.2,4.72 28.2,6.65 28.19,6.66 28.19,6.76 v1(27.06,7.89)
BOOT1: length 16.6
  Top Layer w0.254: R23.1 36.28,10.52 v1(34.87,10.52) U21.20
  Inner2 w0.254: H3.7 41.15,3.32 39.38,3.32 38.49,4.21 38.49,6.89 v1(34.87,10.52)
CC1: length 12.1
  Top Layer w0.254: v1(8.66,23.02) 8.56,23.12 USB2.A5 ; v1(9.91,25.04) 9.91,27.07 8.52,28.47 6.48,28.47 5.48,29.47 R14.1
  Inner2 w0.254: v1(8.66,23.02) 8.74,23.1 9.31,23.1 9.66,23.44 9.66,23.88 9.91,24.13 v1(9.91,25.04)
CC2: length 16.7
  Top Layer w0.254: v1(10.8,24.91) 10.8,27.32 7.75,30.37 6.24,30.37 R15.1
  Inner2 w0.254: v1(9.92,21.24) 10.18,21.24 10.8,21.86 v1(10.8,24.91)
  Bottom Layer w0.254: USB2.B5 8.5,21.62 8.88,21.24 v1(9.92,21.24)
CTRL_TS_LED: length 46.5
  Top Layer w0.254: v1(30.36,15.26) 30.73,14.89 U21.25 ; v1(3.82,36.34) 3.82,37.9 LED9.1
  Inner2 w0.254: v1(16.9,21.86) 16.9,24.15 v1(16.26,24.78)
  Bottom Layer w0.254: v1(30.36,15.26) 29.47,15.26 27.57,13.35 21.85,13.35 16.9,18.31 v1(16.9,21.86) ; v1(3.82,36.34) 3.82,34.69 5.09,33.42 7.63,33.42 v1(16.26,24.78)
CTRL_UP_LED: length 50.1
  Top Layer w0.254: LED8.1 3.05,39.29 v1(3.05,36.47) ; v1(29.09,12.34) 29.34,12.34 30.23,13.22 U21.26
  Inner2 w0.254: v1(13.85,19.07) v1(13.85,25.93)
  Bottom Layer w0.254: v1(3.05,36.47) 3.05,34.43 4.7,32.78 6.99,32.78 v1(13.85,25.93) ; v1(13.85,19.07) 20.45,12.46 21.34,12.46 21.98,11.83 28.58,11.83 v1(29.09,12.34)
DBG_RX: length 23.4
  Top Layer w0.254: U21.31 27.73,15.09 v1(27.69,15.13)
  Inner2 w0.254: v1(30.11,7.26) 30.11,8.27 26.8,11.57 26.8,13.35 27.69,14.24 v1(27.69,15.13)
  Bottom Layer w0.254: H3.3 35.82,0.78 32.64,0.78 32.39,1.03 32.39,2.81 30.11,5.1 v1(30.11,7.26)
DBG_TX: length 17.3
  Top Layer w0.254: U21.30 28.23,15.28 v1(28.33,15.38)
  Inner2 w0.254: H3.1 30.74,6.11 30.74,8.53 28.33,10.94 28.33,12.36 28.34,12.37 28.34,12.81 28.33,12.82 v1(28.33,15.38)
DOWN_VCC_EN: length 39.8
  Top Layer w0.158: Q2.1 30.68,36.02 v1(30.74,35.96) ; v1(26.93,33.04) 28.07,34.18 v1(29.98,34.18) ; U21.18 36.68,9.52 37.6,10.43 37.6,13.73 v1(37.09,14.24)
  Bottom Layer w0.158: v1(30.74,35.96) 30.74,34.94 v1(29.98,34.18) ; v1(26.93,33.04) 27.18,33.04 30.36,29.86 30.36,27.2 30.09,26.93 30.09,24.16 30.74,23.51 30.74,20.59 v1(37.09,14.24)
HS_D+: length 5.2
  Top Layer w0.158: U19.63 26.73,18.67 arc(26.74,18.64) 26.75,18.62 arc(26.77,18.59) 26.77,18.56 26.77,14.22 arc(26.77,14.19) 26.75,14.17 arc(26.73,14.14) 26.73,14.11 U21.33
HS_D-: length 5.2
  Top Layer w0.158: U19.64 27.13,18.67 arc(27.12,18.64) 27.11,18.62 arc(27.09,18.59) 27.08,18.56 27.08,14.71 arc(27.09,14.67) 27.09,14.63 27.09,14.37 arc(27.11,14.28) 27.16,14.21 arc(27.21,14.14) 27.23,14.05 U21.32
HUB_CLK_IN: length 2.9
  Top Layer w0.254: U19.45 19.43,21.4 arc(18.76,21.12) 18.48,20.44 X7.3
MCU_CLK_IN: length 2.3
  Top Layer w0.254: U21.5 27.23,3.35 X8.3
MUX_EN: length 71.3
  Top Layer w0.254: v1(34.3,7) 32.24,7 ; 32.24,7 U21.13 ; 32.24,7 32.52,6.72 v1(32.52,5.99) ; v1(41.92,31.51) v1(41.92,30.12) ; U3.2 v1(44.51,37.23)
  Inner1 w0.254: v1(22.99,3.19) 29.72,3.19 v1(32.52,5.99)
  Bottom Layer w0.254: v1(41.92,30.12) 41.92,29.99 46.61,25.29 46.61,13.86 39.76,7 v1(34.3,7) ; 9.02,2.05 10.67,3.7 17.39,3.7 18.03,3.06 22.87,3.06 v1(22.99,3.19) ; v1(44.51,37.23) 44.51,34.11 v1(41.92,31.51)
RD_1V2: length 13.4
  Top Layer w0.254: U2.3 35.85,20.8 arc(35.85,20.77) v1(35.83,20.77) ; TP1.1 40.22,28.3 C42.2 arc(39.15,27.59) 38.76,27.35 arc(38.46,26.93) 38.35,26.43 U2.17
  Bottom Layer w0.254: v1(35.83,20.77) 37.96,20.77 arc(38.62,21.04) 38.9,21.7 38.9,27.2 arc(38.88,27.25) v1(38.83,27.27)
RD_D+: length 7.2
  Top Layer w0.158: U2.32 33.71,22.18 arc(33.65,22.2) 33.6,22.23 arc(33.55,22.27) 33.48,22.28 33.39,22.28 arc(32.94,22.47) 32.75,22.93 32.75,22.97 arc(32.61,23.29) 32.3,23.43 30.66,23.43 arc(30.41,23.38) 30.2,23.24 29.43,22.47 arc(29.18,22.3) 28.89,22.24 28.76,22.24 arc(28.73,22.24) 28.71,22.22 arc(28.68,22.2) 28.66,22.2 U19.6
RD_D-: length 7.2
  Top Layer w0.158: U2.31 33.71,22.68 arc(33.65,22.67) 33.6,22.64 arc(33.55,22.6) 33.48,22.59 33.39,22.59 arc(33.16,22.69) 33.06,22.93 33.06,22.97 arc(32.83,23.51) 32.3,23.74 30.66,23.74 arc(30.29,23.66) 29.99,23.46 29.21,22.69 arc(29.07,22.59) 28.89,22.55 28.76,22.55 arc(28.73,22.56) 28.71,22.57 arc(28.68,22.59) 28.66,22.6 U19.7
RD_RX+: length 7.4
  Top Layer w0.158: U2.4 36.35,21.04 arc(36.37,20.98) 36.4,20.93 arc(36.44,20.88) 36.45,20.81 36.45,20.54 arc(36.41,20.45) 36.32,20.42 36.23,20.42 arc(36.11,20.29) 36.23,20.16 36.32,20.16 arc(36.41,20.13) 36.45,20.04 36.45,19.54 arc(36.2,18.93) 35.6,18.68 33.06,18.68 arc(32.86,18.72) 32.69,18.84 C66.2
RD_RX-: length 7.4
  Top Layer w0.158: C67.2 32.69,18.22 arc(32.86,18.33) 33.06,18.37 35.6,18.37 arc(36.42,18.71) 36.76,19.54 36.76,20.81 arc(36.77,20.88) 36.81,20.93 arc(36.84,20.98) 36.85,21.04 U2.5
RD_TX+: length 2.7
  Top Layer w0.158: U19.5 28.66,21.8 arc(28.68,21.79) 28.71,21.77 arc(28.73,21.76) 28.76,21.75 29.76,21.75 arc(29.92,21.78) 30.05,21.88 C15.1
RD_TX-: length 2.7
  Top Layer w0.158: U19.4 28.66,21.4 arc(28.68,21.4) 28.71,21.42 arc(28.73,21.44) 28.76,21.44 29.76,21.44 arc(29.92,21.41) 30.06,21.31 C16.1
SEL0: length 74.1
  Top Layer w0.254: v1(28.33,7.76) 28.59,8.03 30.07,8.03 30.46,7.64 30.61,7.64 30.73,7.52 U21.14 34.07,7.52 34.08,7.52 34.51,7.52 34.52,7.52 38.37,7.52 40.39,9.54 v1(40.39,12.72) ; v1(36.33,36.97) 37.34,36.97 37.51,36.81 U3.16 ; v1(21.6,3.7) 6.1,3.7 5.19,2.78 4.68,2.78 3.94,2.05
  Inner1 w0.254: v1(21.6,3.7) 22.76,3.7 22.78,3.71 24.28,3.71 24.76,4.19 24.76,4.55 25.06,4.86 25.42,4.86 v1(28.33,7.76)
  Inner2 w0.254: v1(42.17,28.97) 42.17,29.63 42.44,29.9 42.44,31.73 42.13,32.03 41.65,32.03 v1(41.41,32.28)
  Bottom Layer w0.254: v1(41.41,32.28) 41.03,32.28 v1(36.33,36.97) ; v1(40.39,12.72) 40.39,13.73 40.01,14.11 40.01,19.58 41.66,21.23 41.66,23.77 42.17,24.27 42.17,24.28 42.78,24.89 42.78,27.84 42.17,28.45 v1(42.17,28.97)
SEL1: length 68.6
  Top Layer w0.254: v1(36.07,36.21) 36.19,36.33 U3.17 ; v1(40.65,29.99) 40.65,30.5 41.03,30.88 v1(41.03,31.51) ; v1(26.49,6.94) 26.92,7.37 27.27,7.37 27.58,7.68 27.58,8.03 28.07,8.53 30.11,8.53 30.61,8.02 U21.15 37.85,8.02 39.63,9.8 v1(39.63,13.23)
  Inner1 w0.254: v1(22.74,4.34) 23.88,4.34 v1(26.49,6.94)
  Bottom Layer w0.254: v1(22.74,4.34) 8.77,4.34 6.48,2.05 ; v1(36.07,36.21) 36.2,36.21 36.33,36.09 36.45,36.09 v1(41.03,31.51) ; v1(39.63,13.23) 39.63,19.83 41.03,21.23 41.03,23.64 42.42,25.04 42.42,27.45 42.27,27.6 42.27,27.85 40.65,29.48 v1(40.65,29.99)
SER_D+: length 34.1
  Top Layer w0.158: v1(31.01,24.89) 30.81,24.69 arc(30.72,24.63) 30.61,24.61 arc(30.51,24.59) 30.42,24.53 29.64,23.75 arc(29.3,23.52) 28.89,23.44 28.76,23.44 arc(28.73,23.44) 28.71,23.42 arc(28.68,23.4) 28.66,23.4 U19.9 ; v1(25.59,41.58) 25.3,41.58 arc(25.2,41.6) 25.11,41.66 arc(25.02,41.72) 24.91,41.74 19.44,41.74 ; U14.4 19.08,41.64 arc(19.15,41.65) 19.2,41.69 arc(19.25,41.72) 19.31,41.73 19.4,41.73 arc(19.41,41.74) 19.41,41.74
  Bottom Layer w0.158: v1(31.01,24.89) 31.21,25.09 arc(31.27,25.18) 31.29,25.29 arc(31.31,25.4) 31.37,25.49 arc(31.7,25.97) 31.81,26.54 31.81,29.19 arc(31.62,30.16) 31.07,30.99 22.96,39.1 arc(22.56,39.7) 22.41,40.41 22.41,40.78 arc(22.69,41.46) 23.37,41.74 25.02,41.74 arc(25.21,41.62) 25.42,41.58 v1(25.59,41.58)
SER_D-: length 34.1
  Top Layer w0.158: U19.10 28.66,23.8 arc(28.68,23.79) 28.71,23.77 arc(28.73,23.76) 28.76,23.75 28.89,23.75 arc(29.18,23.81) 29.42,23.97 30.2,24.75 arc(30.26,24.84) 30.28,24.94 arc(30.3,25.05) 30.36,25.14 v1(30.56,25.34) ; 19.41,42.05 24.91,42.05 arc(25.02,42.08) 25.11,42.14 arc(25.2,42.2) 25.3,42.22 v1(25.59,42.22) ; U14.5 19.08,42.14 arc(19.15,42.13) 19.2,42.09 19.2,42.09 arc(19.25,42.06) 19.31,42.04 19.36,42.04 arc(19.38,42.05) 19.41,42.05
  Bottom Layer w0.158: v1(25.59,42.22) 25.42,42.22 arc(25.21,42.17) 25.02,42.05 23.37,42.05 arc(22.48,41.68) 22.1,40.78 22.1,40.41 arc(22.27,39.58) 22.74,38.88 30.85,30.77 arc(31.33,30.05) 31.5,29.19 31.5,26.54 arc(31.41,26.09) 31.15,25.7 arc(31.06,25.64) 30.96,25.62 arc(30.85,25.6) 30.76,25.54 v1(30.56,25.34)
SPI_CK: length 8.5
  Top Layer w0.254: U5.6 44.7,21.25 arc(44,22.96) 42.29,23.66 39.03,23.66 arc(39.02,23.67) U2.12
SPI_CS: length 17.5
  Top Layer w0.254: U2.13 42.8,24.18 arc(44.6,23.44) 45.34,21.64 45.34,18.33 arc(45.04,17.61) 44.32,17.31 42.93,17.31 arc(42.39,17.09) 42.16,16.55 U5.1
SPI_MISO: length 12.3
  Top Layer w0.254: v2(43.18,21.63) 42.87,21.94 arc(42.72,22.07) 42.57,22.2 arc(42.37,22.27) 42.21,22.42 arc(41.66,22.62) 41.07,22.68 U2.10 ; v2(44.07,16.68) 44.07,15.82 arc(43.9,14.99) U5.2
  Bottom Layer w0.254: v2(44.07,16.68) 44.07,19.69 arc(43.88,20.66) 43.33,21.48 v2(43.18,21.63)
SPI_MOSI: length 9.3
  Top Layer w0.254: U5.5 v2(45.97,21.76) ; U2.11 40.54,23.18 arc(41.63,23.08) v2(42.67,22.77)
  Bottom Layer w0.254: v2(45.97,21.76) 45.7,22.03 arc(44.88,22.58) 43.91,22.77 v2(42.67,22.77)
SWCLK: length 21.2
  Top Layer w0.254: U21.37 v1(22.61,12.52)
  Inner2 w0.254: v1(22.61,12.52) 23.83,12.52 v1(26.55,9.8)
  Bottom Layer w0.254: v1(26.55,9.8) 27.82,8.53 29.6,8.53 31.38,6.75 31.38,4.97 33.03,3.32 33.28,3.32 33.41,3.45 36.07,3.45 37.22,4.59 H3.4
SWDIO: length 15
  Top Layer w0.254: U21.34 v1(26.23,12.46)
  Inner2 w0.254: v1(26.23,12.46) 26.23,11.01 v1(27.44,9.8)
  Bottom Layer w0.254: H3.2 32.64,4.72 31.88,5.48 31.88,7 29.72,9.16 28.07,9.16 v1(27.44,9.8)
TF_1V2: length 50.8
  Top Layer w0.254: v1(29.45,20.97) 28.76,20.97 28.75,20.98 28.15,20.98 U19.3 ; U19.27 23.13,27.73 v1(22.7,28.15) 22.05,28.8 C55.1 ; U19.49 v1(21.13,18.4) 21.13,17.71 C57.1 ; TP2.1 28.79,31.01 ; U19.58 v1(24.73,18.44) 24.73,17.9 C65.2 ; U19.40 20.11,23.38 19.61,23.38 19.61,23.37 v1(18.75,23.37) arc(18.15,23.29) 17.59,23.03 ; U19.13 28.97,25 arc(28.98,25) v1(28.99,25.01) ; C72.1 28.1,18.48 arc(28.07,18.64) v1(27.98,18.78)
  Bottom Layer w0.508: 19.72,23.01 22.91,26.2 arc(23.23,26.67) 23.34,27.23 ; 19.72,23.01 arc(20.1,22.51) 20.23,21.89 20.23,20.18 arc(20.45,19.64) 20.99,19.42 22.15,19.42 ; 19.72,23.01 arc(19.27,23.28) v1(18.75,23.37) ; 22.15,19.42 23.91,19.42 arc(24.18,19.31) 24.29,19.04 arc(24.37,18.86) 24.55,18.78 25.08,18.78 ; 22.15,19.42 arc(21.43,19.12) v1(21.13,18.4) ; v1(28.87,27.67) v1(29.63,27.67) ; v1(28.87,27.67) arc(28.72,28.03) 28.36,28.18 v1(27.98,28.18) arc(27.68,27.46) 26.96,27.16 23.69,27.16 arc(23.51,27.18) 23.34,27.23 ; v1(28.87,27.67) arc(28.96,27.64) 28.99,27.55 v1(28.99,25.01) 28.99,21.43 arc(29.12,21.1) v1(29.45,20.97) 29.45,19.65 29.46,19.63 arc(28.84,18.99) v1(27.98,18.78) 25.08,18.78 ; 25.08,18.78 arc(24.83,18.68) v1(24.73,18.44) ; 23.34,27.23 arc(22.88,27.59) v1(22.7,28.15)
TF_CLK: length 7.6
  Top Layer w0.158: U3.7 42.01,37.03 arc(41.92,37.49) 41.66,37.89 41.07,38.47 arc(40.94,38.67) 40.89,38.9 40.89,39.22 arc(40.86,39.31) 40.77,39.34 40.29,39.34 arc(40.17,39.47) 40.29,39.6 41.5,39.6 arc(41.62,39.72) 41.5,39.85 41.02,39.85 arc(40.93,39.89) 40.89,39.98 40.89,40.95 arc(40.89,40.96) 40.89,40.97
TF_CMD: length 7.6
  Top Layer w0.158: CARD1.3 38.69,39.91 arc(38.72,39.82) 38.81,39.78 39.24,39.78 arc(39.37,39.66) 39.24,39.53 38.81,39.53 arc(38.72,39.49) 38.69,39.4 38.69,38.95 arc(38.81,38.65) 39.12,38.52 40.03,38.52 arc(40.36,38.46) 40.64,38.27 40.77,38.14 arc(41.32,37.32) 41.51,36.34 U3.8
TF_DAT0: length 7.5
  Top Layer w0.158: U3.6 42.51,37.5 arc(42.58,37.83) 42.76,38.1 42.8,38.14 arc(43.01,38.46) 43.09,38.83 43.09,39.12 arc(43.05,39.21) 42.96,39.25 42.44,39.25 arc(42.32,39.37) 42.44,39.5 43.73,39.5 arc(43.86,39.63) 43.73,39.75 43.21,39.75 arc(43.12,39.79) 43.09,39.88 CARD1.7
TF_DAT1: length 7.6
  Top Layer w0.158: U3.5 43.01,36.82 arc(43.22,37.34) 43.74,37.55 arc(44.14,37.72) 44.31,38.12 44.31,38.77 arc(44.34,38.86) 44.43,38.9 44.9,38.9 arc(45.03,39.03) 44.9,39.15 44.43,39.15 arc(44.31,39.28) 44.43,39.41 44.9,39.41 arc(45.03,39.53) 44.9,39.66 44.43,39.66 arc(44.34,39.7) 44.31,39.79 44.31,40.46 arc(44.28,40.58) 44.22,40.68
TF_DAT2: length 7.5
  Top Layer w0.158: U3.11 40.01,36.74 arc(39.83,37.19) 39.38,37.38 37.34,37.38 arc(36.74,37.63) 36.49,38.23 CARD1.1
TF_DAT3: length 7.7
  Top Layer w0.158: CARD1.2 37.59,39.74 arc(37.55,39.65) 37.46,39.61 37.21,39.61 arc(37.08,39.48) 37.21,39.36 37.46,39.36 arc(37.55,39.32) 37.59,39.23 37.59,38.53 arc(37.74,38.16) 38.1,38.01 39.5,38.01 arc(40.22,37.72) 40.51,37 40.51,36.33
TF_VCC: length 13.9
  Top Layer w0.508: 39.79,40.97 39.79,42.41 38.11,44.09 29.08,44.09 Q4.3
TF_VCC_EN: length 45.9
  Top Layer w0.158: Q4.1 26.54,41.03 25.15,39.64 25.15,37.1 v1(24.45,36.4) ; U21.16 37.46,8.52 38.61,9.67 38.61,10.02 38.7,10.11 38.7,10.5 38.61,10.59 38.61,14.75 v1(37.6,15.77) ; v1(32.01,24.91) 32.01,25.42 v1(30.74,26.69)
  Bottom Layer w0.158: v1(37.6,15.77) 32.64,20.72 32.64,24.27 v1(32.01,24.91) ; v1(24.45,36.4) 30.74,30.12 v1(30.74,26.69)
TS_CLK: length 20.1
  Top Layer w0.158: v2(56.77,31.96) 56.46,31.96 arc(56.37,31.92) 56.34,31.83 56.34,31.66 arc(56.21,31.53) 56.08,31.66 56.08,32.26 arc(55.96,32.39) 55.83,32.26 55.83,31.66 arc(55.7,31.53) 55.58,31.66 55.58,32.26 arc(55.45,32.39) 55.32,32.26 55.32,32.09 arc(55.28,32) 55.19,31.96 54.86,31.96 arc(54.43,31.87) 54.07,31.63 53.58,31.14 arc(52.75,30.59) 51.78,30.39 46.77,30.39 arc(45.8,30.59) 44.98,31.14 44.32,31.79 arc(44.09,32.14) 44.01,32.54 U3.36
  Bottom Layer w0.158: U9.5 v2(56.77,31.96)
TS_CMD: length 20
  Top Layer w0.158: U3.35 43.51,32.76 arc(43.66,32.03) 44.07,31.41 44.98,30.5 arc(45.8,29.95) 46.77,29.76 49.92,29.76 arc(50.01,29.72) 50.05,29.63 50.05,29.46 arc(50.18,29.33) 50.3,29.46 50.3,29.63 arc(50.43,29.76) 50.56,29.63 50.56,29.46 arc(50.69,29.33) 50.81,29.46 50.81,29.63 arc(50.94,29.76) 51.07,29.63 51.07,29.46 arc(51.19,29.33) 51.32,29.46 51.32,29.63 arc(51.45,29.76) 51.57,29.63 51.57,29.46 arc(51.7,29.33) 51.83,29.46 51.83,29.63 arc(51.87,29.72) 51.96,29.76 v2(56.77,29.76)
  Bottom Layer w0.158: U9.3 v2(56.77,29.76)
TS_DAT0: length 20.1
  Top Layer w0.158: U3.37 44.51,32.55 arc(44.57,32.26) 44.73,32.01 45.09,31.66 arc(45.65,31.29) 46.31,31.16 48.52,31.16 arc(48.61,31.19) 48.64,31.28 48.64,31.69 arc(48.77,31.82) 48.9,31.69 48.9,31.28 arc(49.02,31.16) 49.15,31.28 49.15,31.69 arc(49.28,31.82) 49.41,31.69 49.41,31.28 arc(49.53,31.16) 49.66,31.28 49.66,31.69 arc(49.79,31.82) 49.91,31.69 49.91,31.28 arc(49.95,31.19) 50.04,31.16 51.78,31.16 arc(52.75,31.35) 53.58,31.9 55.18,33.5 arc(55.91,33.99) v2(56.77,34.16)
  Bottom Layer w0.158: U9.7 v2(56.77,34.16)
TS_DAT1: length 20.1
  Top Layer w0.158: v2(56.77,35.26) 53.07,35.26 arc(52.98,35.22) 52.94,35.13 52.94,34.58 arc(52.81,34.46) 52.69,34.58 52.69,35.13 arc(52.56,35.26) 52.43,35.13 52.43,34.58 arc(52.3,34.46) 52.18,34.58 52.18,35.13 arc(52.05,35.26) 51.92,35.13 51.92,34.58 arc(51.8,34.46) 51.67,34.58 51.67,35.13 arc(51.63,35.22) 51.54,35.26 51.26,35.26 arc(50.29,35.07) 49.46,34.52 47.5,32.55 arc(47.08,32.27) 46.58,32.17 45.39,32.17 arc(45.12,32.28) 45.01,32.55 U3.38
  Bottom Layer w0.158: U9.8 v2(56.77,35.26)
TS_DAT2: length 20.1
  Top Layer w0.158: v2(56.77,27.56) 46.56,27.56 arc(45.59,27.75) 44.76,28.3 43.26,29.81 arc(42.71,30.63) 42.51,31.61 U3.33
  Bottom Layer w0.158: U9.1 v2(56.77,27.56)
TS_DAT3: length 20.1
  Top Layer w0.158: v2(56.77,28.66) 49.45,28.66 arc(49.36,28.7) 49.32,28.79 49.32,28.93 arc(49.19,29.05) 49.07,28.93 49.07,28.39 arc(48.94,28.26) 48.81,28.39 48.81,28.53 arc(48.78,28.62) 48.69,28.66 46.48,28.66 arc(45.5,28.85) 44.68,29.4 43.76,30.33 arc(43.21,31.15) 43.01,32.12 U3.34
  Bottom Layer w0.158: U9.2 v2(56.77,28.66)
TS_RXD: length 20.4
  Top Layer w0.254: U14.25 16.04,38.42 arc(16,38.2) v1(15.88,38.01)
  Bottom Layer w0.254: H2.2 22.36,49.95 arc(21.53,49.79) 20.83,49.32 arc(20.36,48.61) 20.19,47.78 20.19,41.48 arc(20,40.51) 19.45,39.68 17.2,37.43 arc(17,37.3) 16.76,37.25 16.64,37.25 arc(16.1,37.47) v1(15.88,38.01)
TS_TXD: length 20
  Top Layer w0.254: U14.26 16.54,38.55 arc(16.6,38.26) v1(16.76,38.01)
  Bottom Layer w0.254: v1(16.76,38.01) 18.31,39.56 arc(18.86,40.38) 19.05,41.35 19.05,47.76 arc(19.24,48.73) 19.79,49.55 22.23,51.98 arc(22.79,52.36) 23.45,52.49 H2.1
TS_VCC: length 34.1
  Top Layer w0.508: v1(34.33,31.48) v1(33.79,32.02) 30.61,35.2 29.6,35.2 28.77,36.02 Q3.2
  Bottom Layer w0.508: v1(33.79,32.02) v1(34.33,31.48) arc(35.1,30.99) 36,30.86 U9.4
UP_CHO: length 52.7
  Top Layer w0.254: v1(30.74,11.07) 30.74,9.54 31.27,9.02 U21.17 36.94,9.02 v1(38.23,10.3) 38.23,14.13 v1(36.07,16.29) ; v1(31.38,24.27) 32.64,24.27 33.23,23.68 U2.29
  Inner1 w0.254: v1(30.74,11.07) 27.82,8.15 27.54,8.15 27.27,8.41 26.84,8.41 26.57,8.15 v1(25.91,8.15) 17.53,8.15 H4.4
  Bottom Layer w0.254: v1(31.38,24.27) 31.38,20.98 v1(36.07,16.29)
UP_CLK: length 7.6
  Top Layer w0.158: U3.27 39.51,32.13 arc(39.32,31.16) 38.77,30.34 37.6,29.17 arc(37.05,28.34) 36.85,27.37 U2.20
UP_CMD: length 7.6
  Top Layer w0.158: U3.26 39.01,32.34 arc(38.82,31.37) 38.27,30.54 37.1,29.37 arc(36.55,28.55) 36.35,27.58 U2.21
UP_D+: length 21.7
  Top Layer w0.158: TP8.1 11.85,23 v1(11.56,22.71) 11.27,22.71 arc(11.17,22.69) 11.08,22.63 arc(10.99,22.57) 10.88,22.55 9.64,22.55 ; v1(17.1,25.31) 17.3,25.11 arc(17.39,25.05) 17.5,25.02 arc(17.61,25) 17.7,24.94 17.78,24.86 arc(18.02,24.7) 18.31,24.64 19.49,24.64 arc(19.52,24.64) 19.55,24.62 arc(19.57,24.6) 19.6,24.6 U19.37 ; 9.64,22.55 8.22,22.55 arc(8.16,22.56) 8.11,22.59 arc(8.05,22.63) 7.99,22.64 6.95,22.64 USB2.A6 ; 9.64,22.55 v1(9.81,22.71)
  Bottom Layer w0.158: v1(17.1,25.31) 17.3,25.11 arc(17.39,25.05) 17.5,25.02 arc(17.61,25) 17.7,24.94 arc(17.88,24.67) 17.94,24.34 arc(17.42,23.07) 16.15,22.55 12.23,22.55 arc(12.13,22.57) 12.04,22.63 arc(11.95,22.69) 11.84,22.71 v1(11.56,22.71) ; USB2.B6 8.56,22.12 9.1,21.58 9.49,21.58 9.77,21.86 9.77,22.25 9.81,22.29 v1(9.81,22.71)
UP_D-: length 20.7
  Top Layer w0.158: 9.11,22.24 10.88,22.24 arc(10.99,22.22) 11.08,22.16 arc(11.17,22.1) 11.27,22.07 v1(11.56,22.07) 11.57,22.06 TP7.1 ; 9.11,22.24 8.22,22.24 arc(8.16,22.22) 8.11,22.19 arc(8.05,22.15) 7.99,22.14 6.95,22.14 USB2.A7 ; 9.11,22.24 v1(9.3,22.05) ; v1(17.55,25.76) 17.75,25.55 arc(17.81,25.46) 17.83,25.36 arc(17.85,25.25) 17.91,25.16 18,25.08 arc(18.14,24.99) 18.31,24.95 19.49,24.95 arc(19.52,24.96) 19.55,24.97 arc(19.57,24.99) 19.6,25 U19.36
  Bottom Layer w0.158: 6.93,22.62 8.39,22.62 8.47,22.55 8.8,22.55 v1(9.3,22.05) ; v1(11.56,22.07) 11.84,22.07 arc(11.95,22.1) 12.04,22.16 arc(12.13,22.22) 12.23,22.24 16.15,22.24 arc(17.64,22.85) 18.25,24.34 arc(18.17,24.79) 17.91,25.16 arc(17.85,25.25) 17.83,25.36 arc(17.81,25.46) 17.75,25.55 v1(17.55,25.76)
UP_DAT0: length 7.6
  Top Layer w0.158: U2.19 37.35,27.16 arc(37.55,28.13) 38.1,28.96 39.27,30.13 arc(39.82,30.95) 40.01,31.93 U3.28
UP_DAT1: length 7.6
  Top Layer w0.158: U3.29 40.51,31.72 arc(40.32,30.75) 39.77,29.92 38.6,28.75 ; U2.18 37.85,26.96 arc(38.05,27.93) 38.6,28.75
UP_DAT2: length 7.6
  Top Layer w0.158: U2.23 35.35,27.99 arc(35.55,28.96) 36.1,29.79 37.27,30.96 arc(37.82,31.78) 38.01,32.75 U3.24
UP_DAT3: length 7.6
  Top Layer w0.158: U2.22 35.85,27.78 arc(36.05,28.76) 36.6,29.58 37.77,30.75 arc(38.32,31.57) 38.51,32.55 U3.25
UP_LED: length 46.2
  Top Layer w0.254: v1(33.79,30.88) 32.26,30.88 31.5,31.64 31.5,32.15 31.25,32.4 23.88,32.4 22.36,33.93 13.98,33.93 11.69,36.21 6.57,36.21 LED5.1 ; U2.14 39.03,24.7 v1(41.15,24.7)
  Bottom Layer w0.254: 41.2,24.7 41.92,25.42 41.92,27.7 39.63,29.99 34.68,29.99 v1(33.79,30.88)
UP_RX+: length 8.6
  Top Layer w0.158: v1(12.27,21.32) 12.7,21.32 arc(13.01,21.45) C63.1
  Bottom Layer w0.158: v1(12.27,21.32) 11.98,21.32 arc(11.88,21.3) 11.79,21.24 arc(11.7,21.18) 11.59,21.15 11.48,21.15 arc(10.91,21.39) 10.67,21.96 10.67,22.65 arc(10.11,23.99) 8.77,24.55 8.22,24.55 arc(8.16,24.56) 8.11,24.59 arc(8.05,24.63) 7.99,24.64 7.05,24.64
UP_RX-: length 8.6
  Top Layer w0.158: v1(12.27,20.68) 12.69,20.68 arc(13.01,20.55) C64.1
  Bottom Layer w0.158: v1(12.27,20.68) 11.98,20.68 arc(11.88,20.7) 11.79,20.76 arc(11.7,20.82) 11.59,20.84 11.48,20.84 arc(10.69,21.17) 10.36,21.96 10.36,22.65 arc(9.89,23.77) 8.77,24.24 8.22,24.24 arc(8.16,24.22) 8.11,24.19 arc(8.05,24.15) 7.99,24.14 7.05,24.14
UP_TX+: length 6.4
  Top Layer w0.158: C60.1 12.84,24.4 arc(12.54,24.2) 12.19,24.13 11.19,24.13 arc(10.98,24.18) 10.8,24.3 arc(10.52,24.48) 10.19,24.55 8.22,24.55 arc(8.16,24.56) 8.11,24.59 arc(8.05,24.63) 7.99,24.64 7.05,24.64
UP_TX-: length 6.4
  Top Layer w0.158: C61.1 12.84,23.56 arc(12.54,23.75) 12.19,23.82 11.19,23.82 arc(10.86,23.89) 10.58,24.08 arc(10.4,24.2) 10.19,24.24 8.22,24.24 arc(8.16,24.22) 8.11,24.19 arc(8.05,24.15) 7.99,24.14 7.05,24.14
UP_VCC: length 14.1
  Top Layer w0.381: v1(32.85,25.18) v1(33.53,25.18) U2.26
  Top Layer w0.508: v1(32.46,35.07) 32.46,36.85 Q2.2
  Bottom Layer w0.508: v1(32.46,35.07) 32.46,31.44 arc(33.01,30.62) 33.2,29.65 33.2,25.18 ; 33.2,25.18 v1(32.85,25.18) ; 33.2,25.18 v1(33.53,25.18)
UP_VCC_EN: length 32.7
  Top Layer w0.158: Q3.1 26.17,36.27 v1(26.17,33.55) ; v1(33.79,9.99) 32.25,9.99 U21.19
  Bottom Layer w0.158: v1(26.17,33.55) 26.17,32.53 29.98,28.72 29.98,27.99 30.1,27.87 30.1,27.48 29.98,27.35 29.98,27.32 29.6,26.94 29.6,23.77 30.11,23.26 30.11,20.59 34.17,16.53 34.17,10.37 v1(33.79,9.99)
$1N442: length 6.6
  Top Layer w0.254: U2.9 39.45,22.18 arc(39.66,22.1) v1(39.75,21.88) ; v1(41.15,25.57) 42.17,25.57 arc(42.26,25.6) R26.2
  Inner2 w0.254: v1(41.15,25.57) arc(40.7,25.38) 40.51,24.93 40.51,22.65 arc(40.29,22.11) v1(39.75,21.88)
$1N465: length 6.8
  Top Layer w0.158: U2.2 35.35,21.04 arc(35.34,20.98) 35.31,20.93 arc(35.27,20.88) 35.26,20.81 35.26,20.29 arc(35.02,19.72) 34.45,19.49 33.69,19.49 arc(33.29,19.65) 33.13,20.05 33.13,21.02 arc(33,21.32) 32.7,21.45 arc(32.56,21.42) 32.44,21.33 C16.2
$1N466: length 6.8
  Top Layer w0.158: C15.2 32.44,21.87 arc(32.56,21.78) 32.7,21.75 arc(33.22,21.54) 33.44,21.02 33.44,20.05 arc(33.51,19.87) 33.69,19.8 34.45,19.8 arc(34.8,19.94) 34.95,20.29 ; U2.1 34.85,21.04 arc(34.87,20.98) 34.9,20.93 arc(34.94,20.88) 34.95,20.81 arc(34.91,20.72) 34.82,20.69 34.73,20.69 arc(34.61,20.56) 34.73,20.43 34.82,20.43 arc(34.91,20.4) 34.95,20.31
$1N469: length 1.8
  Top Layer w0.254: U2.24 34.85,27.73 C36.1
$1N1150: length 2.1
  Top Layer w0.254: R13.1 9.16,37.36 LED5.2
$1N2251: length 4.5
  Top Layer w0.254: R3.1 40.82,17.12 arc(41.8,17.32) 42.62,17.87 42.69,17.94 arc(43.24,18.76) 43.43,19.73 U5.7
$1N2254: length 2.1
  Top Layer w0.254: U5.3 44.7,12.24 R4.2
$1N5720: length 2
  Top Layer w0.254: U14.11 16.04,46.09 arc(16.03,46.13) R6.2
$1N5721: length 2.2
  Top Layer w0.254: R7.1 17.04,45.51 U14.9
$1N13628: length 3.7
  Top Layer w0.254: R16.2 R17.1 6.11,8.78 arc(6.17,8.93) U17.5
$1N15481: length 19.7
  Top Layer w0.254: LED6.1 5.43,34.85 v1(5.98,34.31) ; v1(11.69,31.77) 12.21,31.25 v1(13.72,31.25) ; U19.32 21.13,28.04 v1(20.58,28.59)
  Bottom Layer w0.254: v1(20.58,28.59) 17.92,31.25 v1(13.72,31.25) ; v1(11.69,31.77) 9.15,34.31 v1(5.98,34.31)
$1N15483: length 2.1
  Top Layer w0.254: R18.1 9.16,35.2 LED6.2
$1N15725: length 19.7
  Top Layer w0.158: v1(19.75,26.94) 19.75,26.87 19.44,26.56 19.44,25.93 19.56,25.8 U19.34
  Top Layer w0.254: LED7.1 6.44,32.02 9.78,32.02 R21.1 11.55,30.24 v1(11.56,30.24)
  Bottom Layer w0.254: v1(19.75,26.94) 19.75,28.53 18.42,29.86 11.94,29.86 v1(11.56,30.24)
$1N15730: length 2.1
  Top Layer w0.254: R20.1 9.16,33.04 LED7.2
$1N15963: length 5.8
  Top Layer w0.158: C60.2 14.9,24.36 arc(15.13,24.21) 15.4,24.15 19.49,24.15 arc(19.52,24.16) 19.55,24.17 arc(19.57,24.19) 19.6,24.2 U19.38
$1N15967: length 5.8
  Top Layer w0.158: C61.2 14.97,23.66 arc(15.17,23.8) 15.4,23.84 19.49,23.84 arc(19.52,23.84) 19.55,23.82 arc(19.57,23.8) 19.6,23.8 U19.39
$1N16097: length 6.4
  Top Layer w0.158: U19.41 19.6,23 arc(19.57,22.99) 19.55,22.97 arc(19.52,22.96) 19.49,22.95 19.37,22.95 arc(18.89,22.86) 18.48,22.58 17.7,21.8 arc(16.98,21.32) 16.12,21.15 16.01,21.15 arc(15.22,21.31) 14.54,21.76
$1N16103: length 6.4
  Top Layer w0.158: U19.42 19.6,22.6 arc(19.57,22.6) 19.55,22.62 arc(19.52,22.64) 19.49,22.64 19.37,22.64 arc(19.01,22.57) 18.7,22.37 17.92,21.58 arc(17.09,21.03) 16.12,20.84 16.01,20.84 arc(15.22,20.68) 14.54,20.23
$1N16323: length 4.3
  Top Layer w0.158: U19.2 28.66,20.6 arc(28.68,20.59) 28.71,20.57 arc(28.73,20.56) 28.76,20.55 28.89,20.55 arc(29.41,20.34) 29.63,19.81 29.63,19.12 arc(29.76,18.81) 30.07,18.68 arc(30.21,18.71) 30.34,18.8 C66.1
$1N16329: length 4.3
  Top Layer w0.158: U19.1 28.66,20.2 arc(28.68,20.2) 28.71,20.22 arc(28.73,20.24) 28.76,20.24 28.89,20.24 arc(29.19,20.12) 29.32,19.81 29.32,19.12 arc(29.54,18.59) 30.07,18.37 arc(30.21,18.34) 30.34,18.26 C67.1
$1N18923: length 2.1
  Top Layer w0.254: LED8.2 9.16,41.68 R24.1
$1N18990: length 2.1
  Top Layer w0.254: 9.16,39.51 9.16,39.52 LED9.2
$1N27147: length 5.5
  Top Layer w0.508: Q3.3 29.28,40.73 Q4.2 31.04,39.27 Q2.3

## Copper pours and planes (outline as drawn; the poured copper is in the pictures)
+5V on Top Layer: 3.3,13.12 7.11,13.12 7.11,10.45 3.3,10.45
GND on Top Layer: 3.22,10.33 12.57,10.33 12.57,4.36 3.22,4.36
GND on Top Layer: -12.31,64.66 53.98,64.66 53.98,-2.78 -12.31,-2.78
GND on Top Layer: 11.81,10.38 14.23,10.38 14.23,4.46 11.81,4.46
GND on Top Layer: 3.24,10.43 12.48,10.43 12.48,8.63 3.24,8.63
GND on Bottom Layer: -6.6,61.74 53.73,61.74 53.73,-5.19 -6.6,-5.19
GND on Inner1: -19.81,71.39 54.11,71.39 54.11,-6.46 -19.81,-6.46
VCC on Top Layer: 23.83,31.68 26.04,31.68 26.04,26.8 23.83,26.8
VCC on Top Layer: 9.39,14.9 12.45,14.9 12.45,10.71 9.39,10.71
VCC on Top Layer: 11.56,15 14.23,15 14.23,10.69 11.56,10.69
VCC on Inner2: -4.57,59.71 53.6,59.71 53.6,-6.46 -4.57,-6.46
TF_1V2 on Top Layer: 27.03,31.28 31.37,31.28 31.37,26.71 27.03,26.71
$1N13369 on Top Layer: 7.24,14.9 9.53,14.9 9.53,10.58 7.24,10.58
$1N14755 on Top Layer: 26.04,31.28 27.56,31.28 27.56,26.8 26.04,26.8

Small or netless copper shapes (teardrops, artwork), in the pictures only: 336 on Top Layer, 91 on Bottom Layer, 8 on Inner1, 34 on Inner2

## Text on the board
Top Silkscreen Layer: PWR OK | HUB UP | SD UP | HOST | BRD
